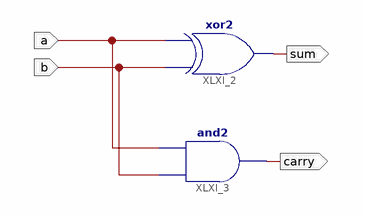
[diagram p0: schematic sheet 1]
// Xilinx ISE schematic half_adder.sch (spartan6) as structural Verilog: 2 symbols, 4 ports
module half_adder (
  input  b,
  input  a,
  output sum,
  output carry
);

  xor XLXI_2 (sum, b, a);
  and XLXI_3 (carry, b, a);
endmodule
